# EAGLE design LP2985-33 (EAGLE 7.7.0)
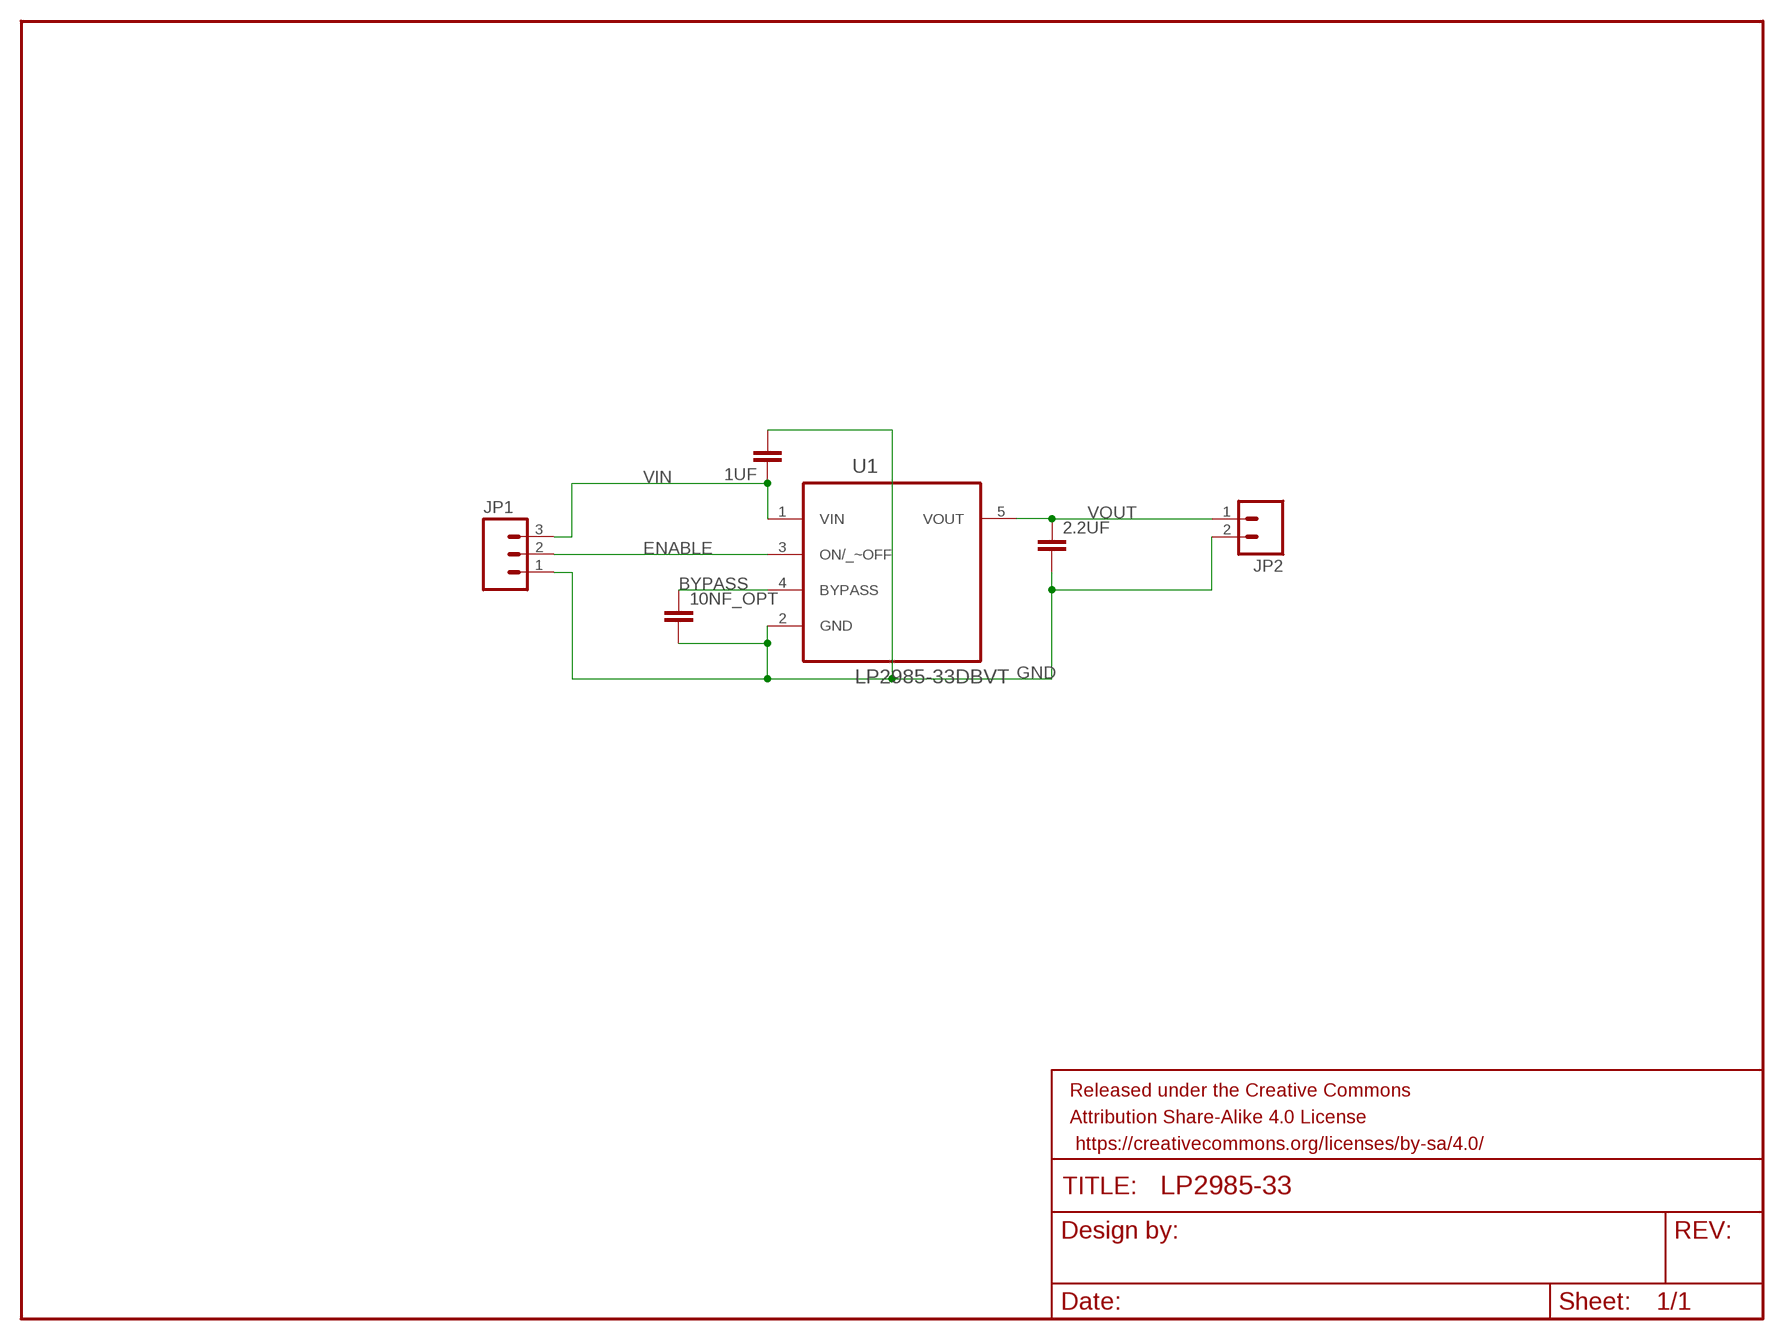
[diagram p0: schematic, sheet 1]

## Parts
1UF  CAP0603-CAP  [0603-CAP]
2.2UF  CAP0603-CAP  [0603-CAP]
10NF_OPT  CAP0603-CAP  [0603-CAP]
FRAME1  FRAME-LETTER  [CREATIVE_COMMONS]
JP1  M03PTH  [1X03]
JP2  M02PTH  [1X02]
U1  LP2985-33DBVT  [SOT95P280X145-5N]

## Nets
BYPASS: 10NF_OPT.1 U1.4(BYPASS)
ENABLE: JP1.2 U1.3(ON/_~OFF)
GND: 1UF.2 2.2UF.2 10NF_OPT.2 JP1.1 JP2.2 U1.2(GND)
VIN: 1UF.1 JP1.3 U1.1(VIN)
VOUT: 2.2UF.1 JP2.1 U1.5(VOUT)

## Library data of the parts
1UF 2.2UF 10NF_OPT = SparkFun-Passives:CAP: Capacitor Standard 0603 ceramic capacitor, and 0.1" leaded capacitor.
FRAME1 = SparkFun-Aesthetics:FRAME-LETTER: Schematic Frame Standard 8.5x11 US Letter frame
JP1 = SparkFun-Connectors:M03: Header 3 Standard 3-pin 0.1" header. Use with straight break away headers (SKU : PRT-00116), right angle break away headers (PRT-00553), swiss pins (PRT-00743), machine pins (PRT-00117), and female headers (PRT-00115). Molex polarized connector foot print use with SKU : PRT-08232 with associated crimp pins and housings.
JP2 = SparkFun-Connectors:M02: Standard 2-pin 0.1" header. Use with - straight break away headers ( PRT-00116) - right angle break away headers (PRT-00553) - swiss pins (PRT-00743) - machine pins (PRT-00117) - female headers (PRT-00115) Molex polarized connector foot print use with: PRT-08233 with associated crimp pins and housings. 2.54_SCREWTERM for use with PRT-10571. 3.5mm Screw Terminal footprints for PRT-08084 5mm Screw Terminal footprints for use with PRT-08432
U1 = LP2985-33DBVT:LP2985-33DBVT: 150-mA LOW-NOISE LOW-DROPOUT REGULATOR WITH SHUTDOWN; AVAILABILITY: Good; DESCRIPTION: Single Output LDO, 150mA, Fixed(3.3V), 1.5% Tolerance, Low Quiescent Current, Low Noise 5-SOT-23 -40 to 125; MF: Texas Instruments; MP: LP2985-33DBVT; PACKAGE: SOT-23 Texas Instruments; PRICE: 0.61 USD

## Board
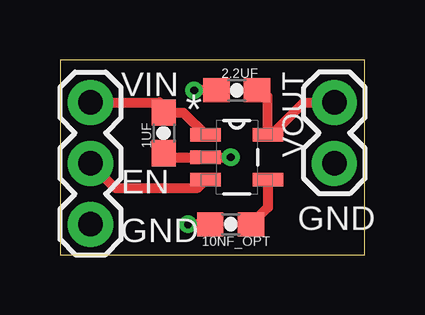
[diagram p1: board, top side]
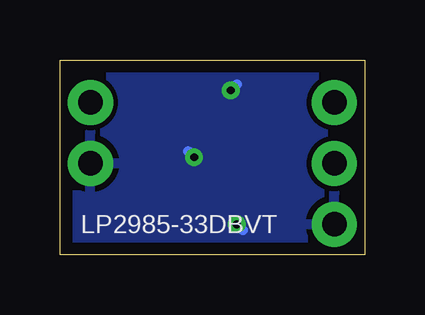
[diagram p2: board, bottom side, seen from below]

Size 12.7 x 8.13 mm. Coordinates in mm from the lower left corner, seen from the top.
Outline: 0,0 12.7,0 12.7,8.13 0,8.13 0,0
Copper layers (1*16): Top 0.035mm / dielectric 1.5mm / Bottom 0.035mm
Design rules "default *": minimum track width 10mil, minimum drill 24mil, track to track 8mil, track to pad 8mil, pad to pad 8mil, via to via 8mil, smd to smd 8mil, copper to edge 20mil, drill to drill 8mil, minimum pad ring 10mil, minimum via ring 8mil, stop-mask expansion 4mil, vias tented up to drill 13mil, thermal gap 10mil

### Footprints (pad centres in the part's own frame; a part is rotated, then mirrored left to right if it is on the bottom)
0603-CAP = smd 1.1 x 1: 1 -0.85,0; 2 0.85,0
1X03 = drill 1.016 pad 1.88: 1 0,0; 2 2.54,0; 3 5.08,0
1X02 = drill 1.016 pad 1.88: 1 0,0; 2 2.54,0
SOT95P280X145-5N = smd 1.27 x 0.559: 1 -1.295,0.94; 2 -1.295,0; 3 -1.295,-0.94; 4 1.295,-0.94; 5 1.295,0.94

### Placement (x,y rotation side)
1UF  4.32,5.08 270 top
2.2UF  7.37,6.86 180 top
10NF_OPT  7.11,1.27 180 top
FRAME1  12.95,-15.75 0 top  (outside the outline)
JP1  1.27,1.27 90 top
JP2  11.43,6.35 270 top
U1  7.37,4.06 0 top

### Tracks (layer width: path | path; a pad name or v marks a point on that pad's centre or on a via)
BYPASS
  Top 0.406: U1.4 8.66,1.97 10NF_OPT.1
ENABLE
  Top 0.406: JP1.2 2.29,2.79 5.74,2.79 U1.3
GND  (via drill 0.33)
  Top 0.406: 1UF.2 4.15,4.23 4.57,4.06 U1.2 v7.11,4.06 | 2.2UF.2 v5.59,6.86 | 10NF_OPT.2 v5.33,1.27
  Bottom 0.406: v7.11,4.06 7.37,4.32 | v5.59,6.86 5.33,7.11 | v5.33,1.27 5.08,1.02
  pour Bottom: -1.02,8.89 13.72,8.89 13.72,-1.78 -1.02,-1.78
VIN
  Top 0.406: JP1.3 4.15,6.35 1UF.1 5.14,5.93 U1.1
VOUT
  Top 0.406: 2.2UF.1 8.38,6.86 8.64,6.6 8.64,5.03 U1.5 8.81,5 10.16,6.35 JP2.1

### Text on the board
tNames: VIN | VOUT | EN | GND | GND